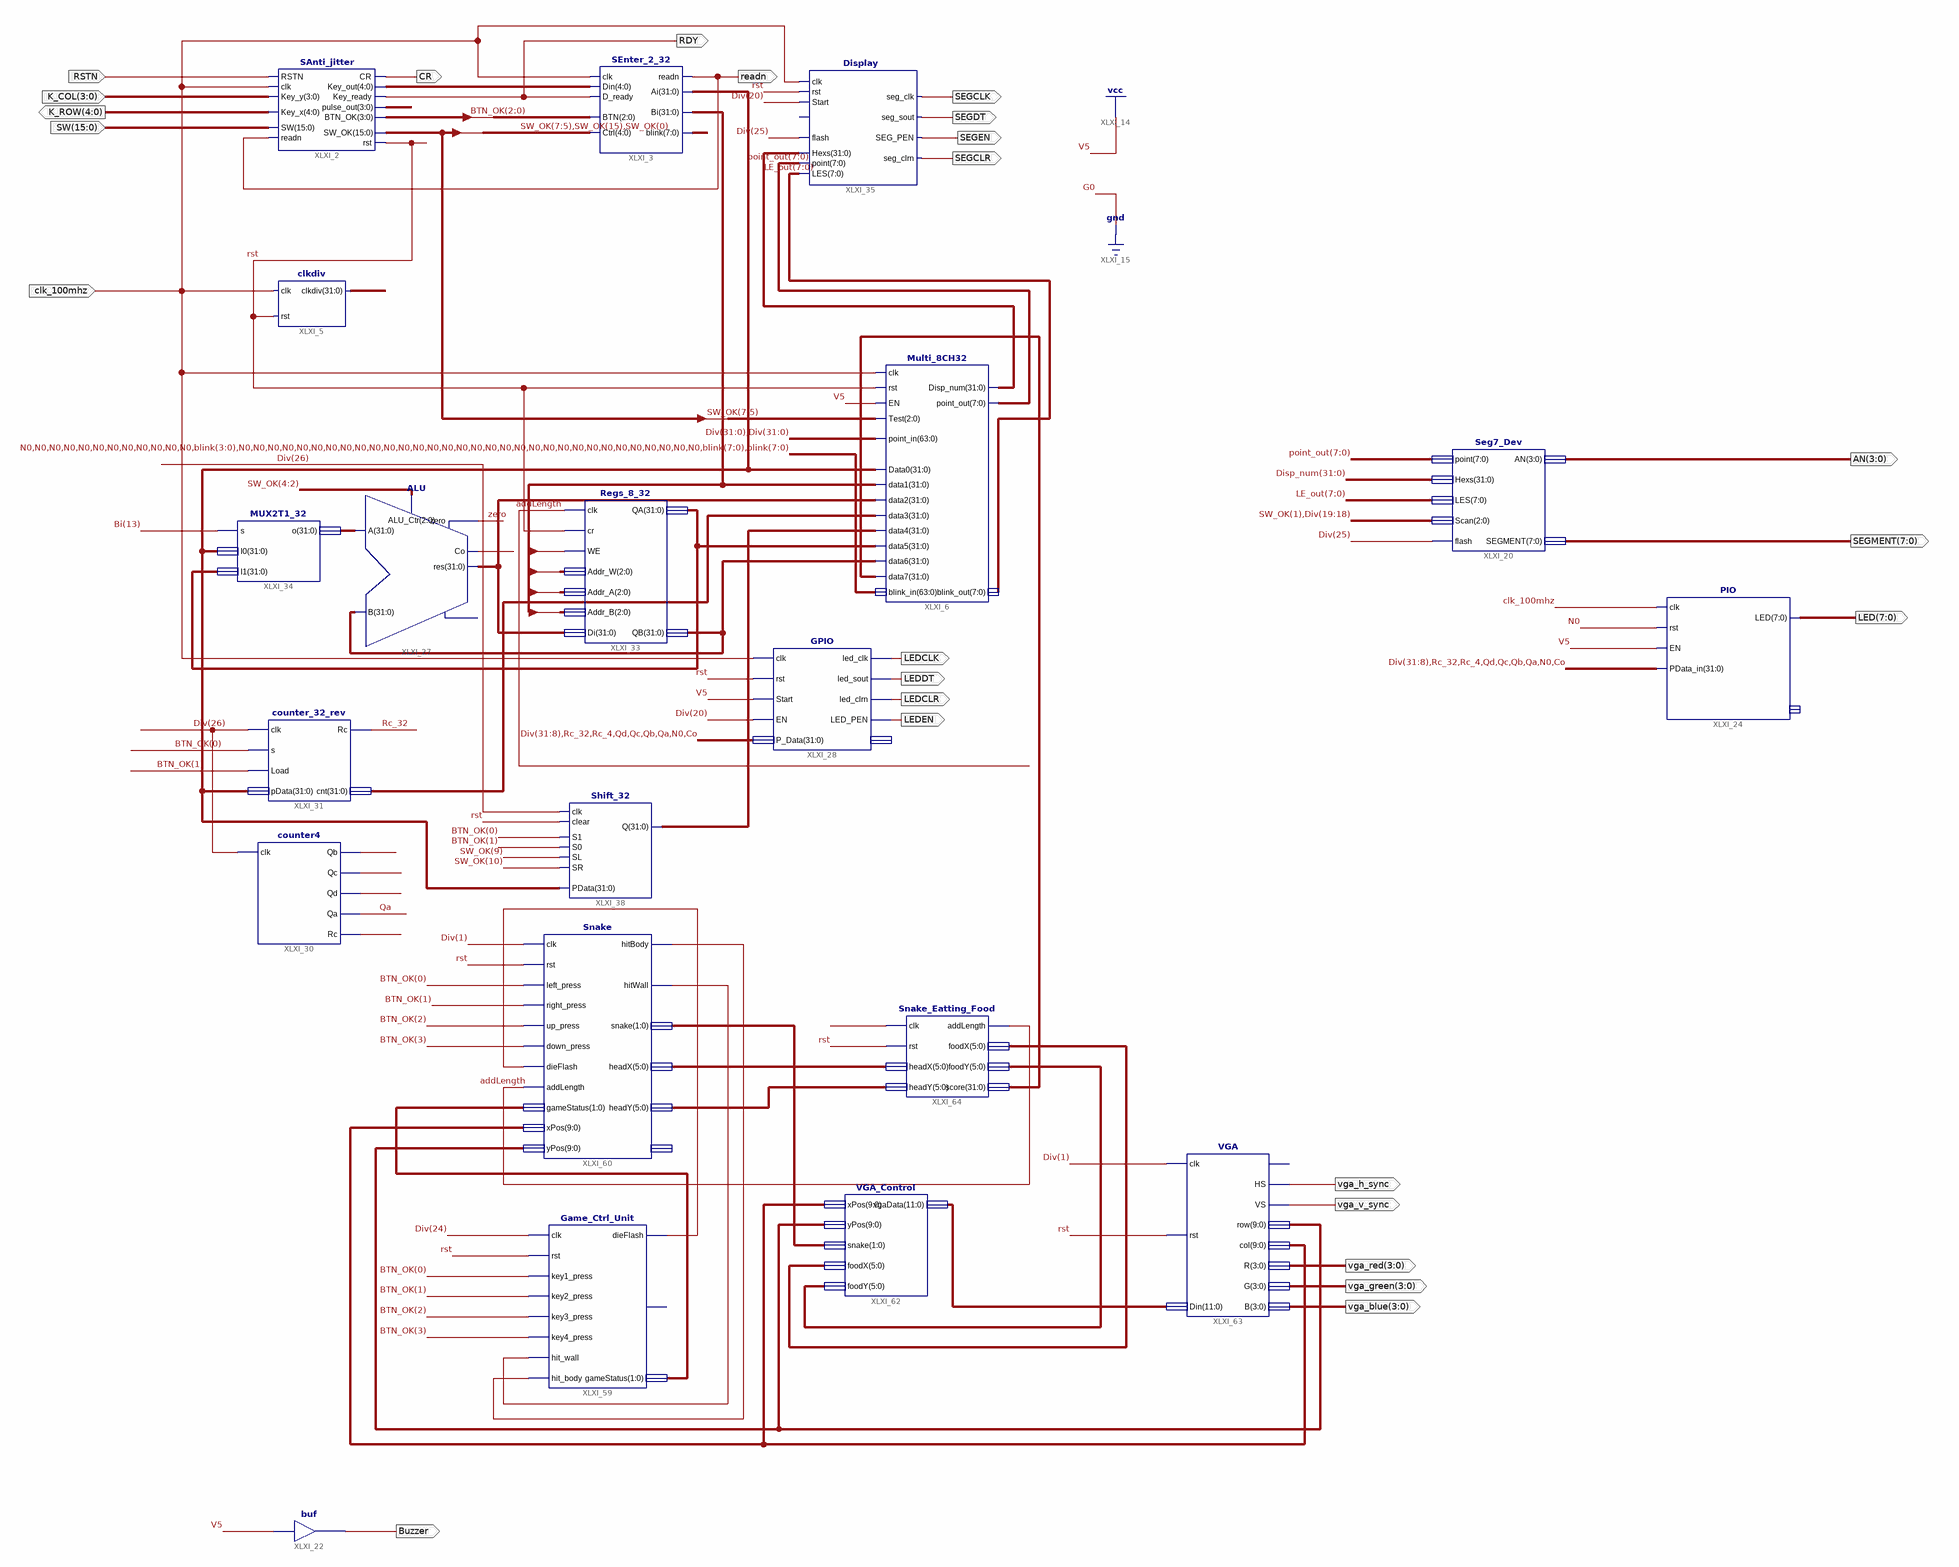
[diagram p0: schematic sheet 1]
// Xilinx ISE schematic Framework_sch.sch (kintex7) as structural Verilog: 20 symbols, 25 ports
module Framework_sch (
  input  clk_100mhz,
  input  [15:0] SW,
  input  [3:0] K_COL,
  input  RSTN,
  output [4:0] K_ROW,
  output CR,
  output RDY,
  output readn,
  output SEGCLK,
  output SEGDT,
  output SEGEN,
  output SEGCLR,
  output LEDCLK,
  output LEDDT,
  output LEDCLR,
  output LEDEN,
  output [3:0] AN,
  output [7:0] SEGMENT,
  output [7:0] LED,
  output Buzzer,
  output vga_h_sync,
  output vga_v_sync,
  output [3:0] vga_red,
  output [3:0] vga_green,
  output [3:0] vga_blue
);

  wire addLength, Co, N0, QA_1bit, QB_1bit, Qc, Qd, Rc_4, Rc_32, rst, XLXN_66, XLXN_188, XLXN_190, XLXN_241,
       zero;
  wire [1:0] XLXN_209, XLXN_232;
  wire [3:0] BTN_OK, Pulse;
  wire [4:0] XLXN_8;
  wire [5:0] XLXN_162, XLXN_181, XLXN_212, XLXN_217;
  wire [7:0] blink, LE_out, point_out;
  wire [9:0] XLXN_191, XLXN_230;
  wire [11:0] XLXN_222;
  wire [15:0] SW_OK;
  wire [31:0] Ai, ALUout, Bi, cnt, Disp_num, Div, QA, QB, XLXN_82, XLXN_101, XLXN_242;

  SAnti_jitter XLXI_2 (
    .SW(SW), .readn(readn), .Key_y(K_COL), .Key_x(K_ROW), .RSTN(RSTN), .clk(clk_100mhz), .Key_out(XLXN_8),
    .Key_ready(RDY), .CR(CR), .rst(rst), .SW_OK(SW_OK), .pulse_out(Pulse), .BTN_OK(BTN_OK));
  SEnter_2_32 XLXI_3 (
    .readn(readn), .Ai(Ai), .Bi(Bi), .blink(blink), .Din(XLXN_8), .D_ready(RDY), .clk(clk_100mhz),
    .Ctrl({SW_OK[7:5], SW_OK[15], SW_OK[0]}), .BTN(BTN_OK[2:0]));
  clkdiv XLXI_5 (.clk(clk_100mhz), .rst(rst), .clkdiv(Div));
  Multi_8CH32 XLXI_6 (
    .clk(clk_100mhz), .rst(rst), .EN(1'b1), .Test(SW_OK[7:5]), .point_in({Div, Div}), .Data0(Ai), .data1(Bi),
    .data2(ALUout), .data3(cnt), .data4(XLXN_101), .data5(QA), .data6(QB), .data7(XLXN_242),
    .point_out(point_out), .Disp_num(Disp_num), .blink_in({{12{N0}}, blink[3:0], {32{N0}}, blink, blink}),
    .blink_out(LE_out));
  ALU XLXI_27 (.A(XLXN_82), .B(QB), .res(ALUout), .zero(zero), .Co(XLXN_66), .ALU_Ctr(SW_OK[4:2]));  // open: overflow
  GPIO XLXI_28 (
    .clk(clk_100mhz), .rst(rst), .Start(1'b1), .EN(Div[20]),
    .P_Data({Div[31:8], Rc_32, Rc_4, Qd, Qc, QB_1bit, QA_1bit, N0, Co}), .led_clk(LEDCLK), .led_sout(LEDDT),
    .led_clrn(LEDCLR), .LED_PEN(LEDEN));  // open: GPIOf0
  counter4 XLXI_30 (.clk(Div[26]), .Qb(QB_1bit), .Qc(Qc), .Qd(Qd), .Qa(QA_1bit), .Rc(Rc_4));
  counter_32_rev XLXI_31 (.clk(Div[26]), .s(BTN_OK[0]), .Load(BTN_OK[1]), .pData(Ai), .Rc(Rc_32), .cnt(cnt));
  Regs_8_32 XLXI_33 (
    .clk(addLength), .cr(rst), .WE(Bi[12]), .Addr_W(Bi[10:8]), .Addr_A(Bi[2:0]), .Addr_B(Bi[6:4]),
    .Di(ALUout), .QA(QA), .QB(QB));
  MUX2T1_32 XLXI_34 (.s(Bi[13]), .I0(Ai), .I1(QA), .o(XLXN_82));
  Display XLXI_35 (
    .clk(clk_100mhz), .flash(Div[25]), .rst(rst), .Start(Div[20]), .Hexs(Disp_num), .LES(LE_out),
    .point(point_out), .seg_clk(SEGCLK), .seg_clrn(SEGCLR), .SEG_PEN(SEGEN), .seg_sout(SEGDT));  // open: SW0
  Shift_32 XLXI_38 (
    .clk(Div[26]), .clear(rst), .S1(BTN_OK[0]), .S0(BTN_OK[1]), .SL(SW_OK[9]), .SR(SW_OK[10]), .PData(Ai),
    .Q(XLXN_101));
  PIO XLXI_24 (
    .clk(clk_100mhz), .rst(N0), .EN(1'b1),
    .PData_in({Div[31:8], Rc_32, Rc_4, Qd, Qc, QB_1bit, QA_1bit, N0, Co}), .LED(LED));  // open: GPIOf0
  Seg7_Dev XLXI_20 (
    .point(point_out), .Hexs(Disp_num), .LES(LE_out), .Scan({SW_OK[1], Div[19:18]}), .flash(Div[25]),
    .AN(AN), .SEGMENT(SEGMENT));
  buf XLXI_22 (Buzzer, 1'b1);
  Game_Ctrl_Unit XLXI_59 (
    .clk(Div[24]), .rst(rst), .key1_press(BTN_OK[0]), .key2_press(BTN_OK[1]), .key3_press(BTN_OK[2]),
    .key4_press(BTN_OK[3]), .hit_wall(XLXN_190), .hit_body(XLXN_188), .dieFlash(XLXN_241),
    .gameStatus(XLXN_232));  // open: restart
  Snake XLXI_60 (
    .clk(Div[1]), .rst(rst), .left_press(BTN_OK[0]), .right_press(BTN_OK[1]), .up_press(BTN_OK[2]),
    .down_press(BTN_OK[3]), .dieFlash(XLXN_241), .addLength(addLength), .gameStatus(XLXN_232),
    .xPos(XLXN_230), .yPos(XLXN_191), .hitBody(XLXN_188), .hitWall(XLXN_190), .snake(XLXN_209),
    .headX(XLXN_181), .headY(XLXN_162));  // open: bodyNum
  VGA_Control XLXI_62 (
    .xPos(XLXN_230), .yPos(XLXN_191), .snake(XLXN_209), .foodX(XLXN_212), .foodY(XLXN_217), .vgaData(XLXN_222));
  VGA XLXI_63 (
    .clk(Div[1]), .rst(rst), .Din(XLXN_222), .HS(vga_h_sync), .VS(vga_v_sync), .row(XLXN_191),
    .col(XLXN_230), .R(vga_red), .G(vga_green), .B(vga_blue));  // open: rdn
  Snake_Eatting_Food XLXI_64 (
    .clk(Div[1]), .rst(rst), .headX(XLXN_181), .headY(XLXN_162), .addLength(addLength), .foodX(XLXN_212),
    .foodY(XLXN_217), .score(XLXN_242));
endmodule
